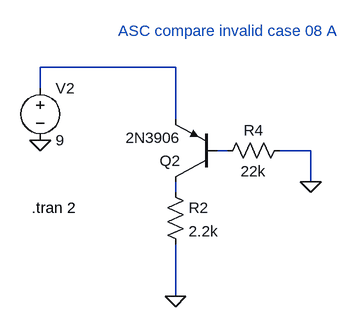
[diagram p0: schematic invalid_case_08_a.asc]
invalid_case_08_a.asc, the LTspice schematic file:
Version 4.1
SHEET 1 880 680
WIRE 192 -64 -16 -64
WIRE -16 -32 -16 -64
WIRE 192 16 192 -64
WIRE 272 64 256 64
WIRE 400 64 352 64
WIRE 400 112 400 64
WIRE 192 128 192 112
WIRE 192 288 192 208
FLAG 400 112 0
FLAG 192 288 0
FLAG -16 48 0
SYMBOL pnp 256 112 R180
SYMATTR InstName Q2
SYMATTR Value 2N3906
SYMBOL res 176 112 R0
SYMATTR InstName R2
SYMATTR Value 2.2k
SYMBOL res 256 80 R270
WINDOW 0 32 56 VTop 2
WINDOW 3 0 56 VBottom 2
SYMATTR InstName R4
SYMATTR Value 22k
SYMBOL voltage -16 -48 R0
WINDOW 123 0 0 Left 2
WINDOW 39 0 0 Left 2
SYMATTR InstName V2
SYMATTR Value 9
TEXT 40 152 Right 2 !.tran 2
TEXT 104 -120 Left 2 ;ASC compare invalid case 08 A

The netlist it stands for:
* invalid_case_08_a.asc
Q2 N003 N002 N001 0 2N3906
R2 N003 0 2.2k
R4 N002 0 22k
V2 N001 0 9
.model NPN NPN
.model PNP PNP
.lib standard.bjt
.tran 2
* ASC compare invalid case 08 A
.backanno
.end